# Altium schematic sheet I2C-PullUps.SchDoc
size A; SheetNumber: 4; SheetTotal: 12
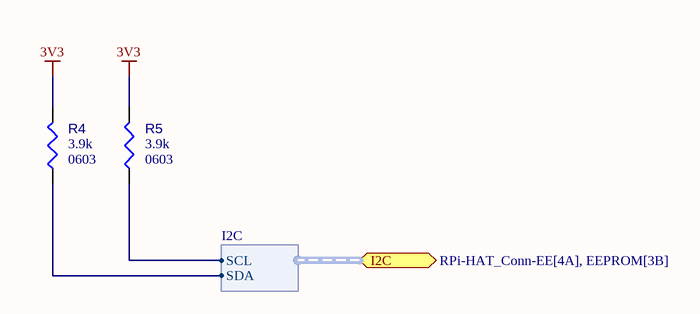
[diagram p0: I2C-PullUps.SchDoc]

## Parts
R4  value 3.9k  Case/Package: 0603  [RESC1608X55X25ML10T15]  (hidden comment: Resistor 1k +/-1% 0603 100 mW)
R5  value 3.9k  Case/Package: 0603  [RESC1608X55X25ML10T15]  (hidden comment: Resistor 1k +/-1% 0603 100 mW)

## Ports
I2C (bidir, harness I2C, see RPi-HAT_Conn-EE[4A], EEPROM[3B])

## Harnesses
I2C: SCL, SDA

## Nets
3V3: R4.2 R5.2
NetR4_1: R4.1 ; port I2C.SDA
NetR5_1: R5.1 ; port I2C.SCL

## Library data of the parts
R4 R5 = CMP-009-00014-5: Chip Resistor, 1 KOhm, +/-1%, 0.1 W, -55 to 155 degC, 0603 (1608 Metric); Voltage Rating: 50V; Power: 100mW; Tolerance: 1%; Mounting Technology: SM; Pins: 2; Min Operating Temperature: -55°C; RoHS Compliant: True; Max Operating Temperature: 155°C